# EasyEDA schematic 1-Schematic_h-bridge driver arduino.json
TITLE: New Schematic; REV: 1.0; Date: 2018-12-11; Sheet: 1/1; Drawn By: ROBBLLOYD
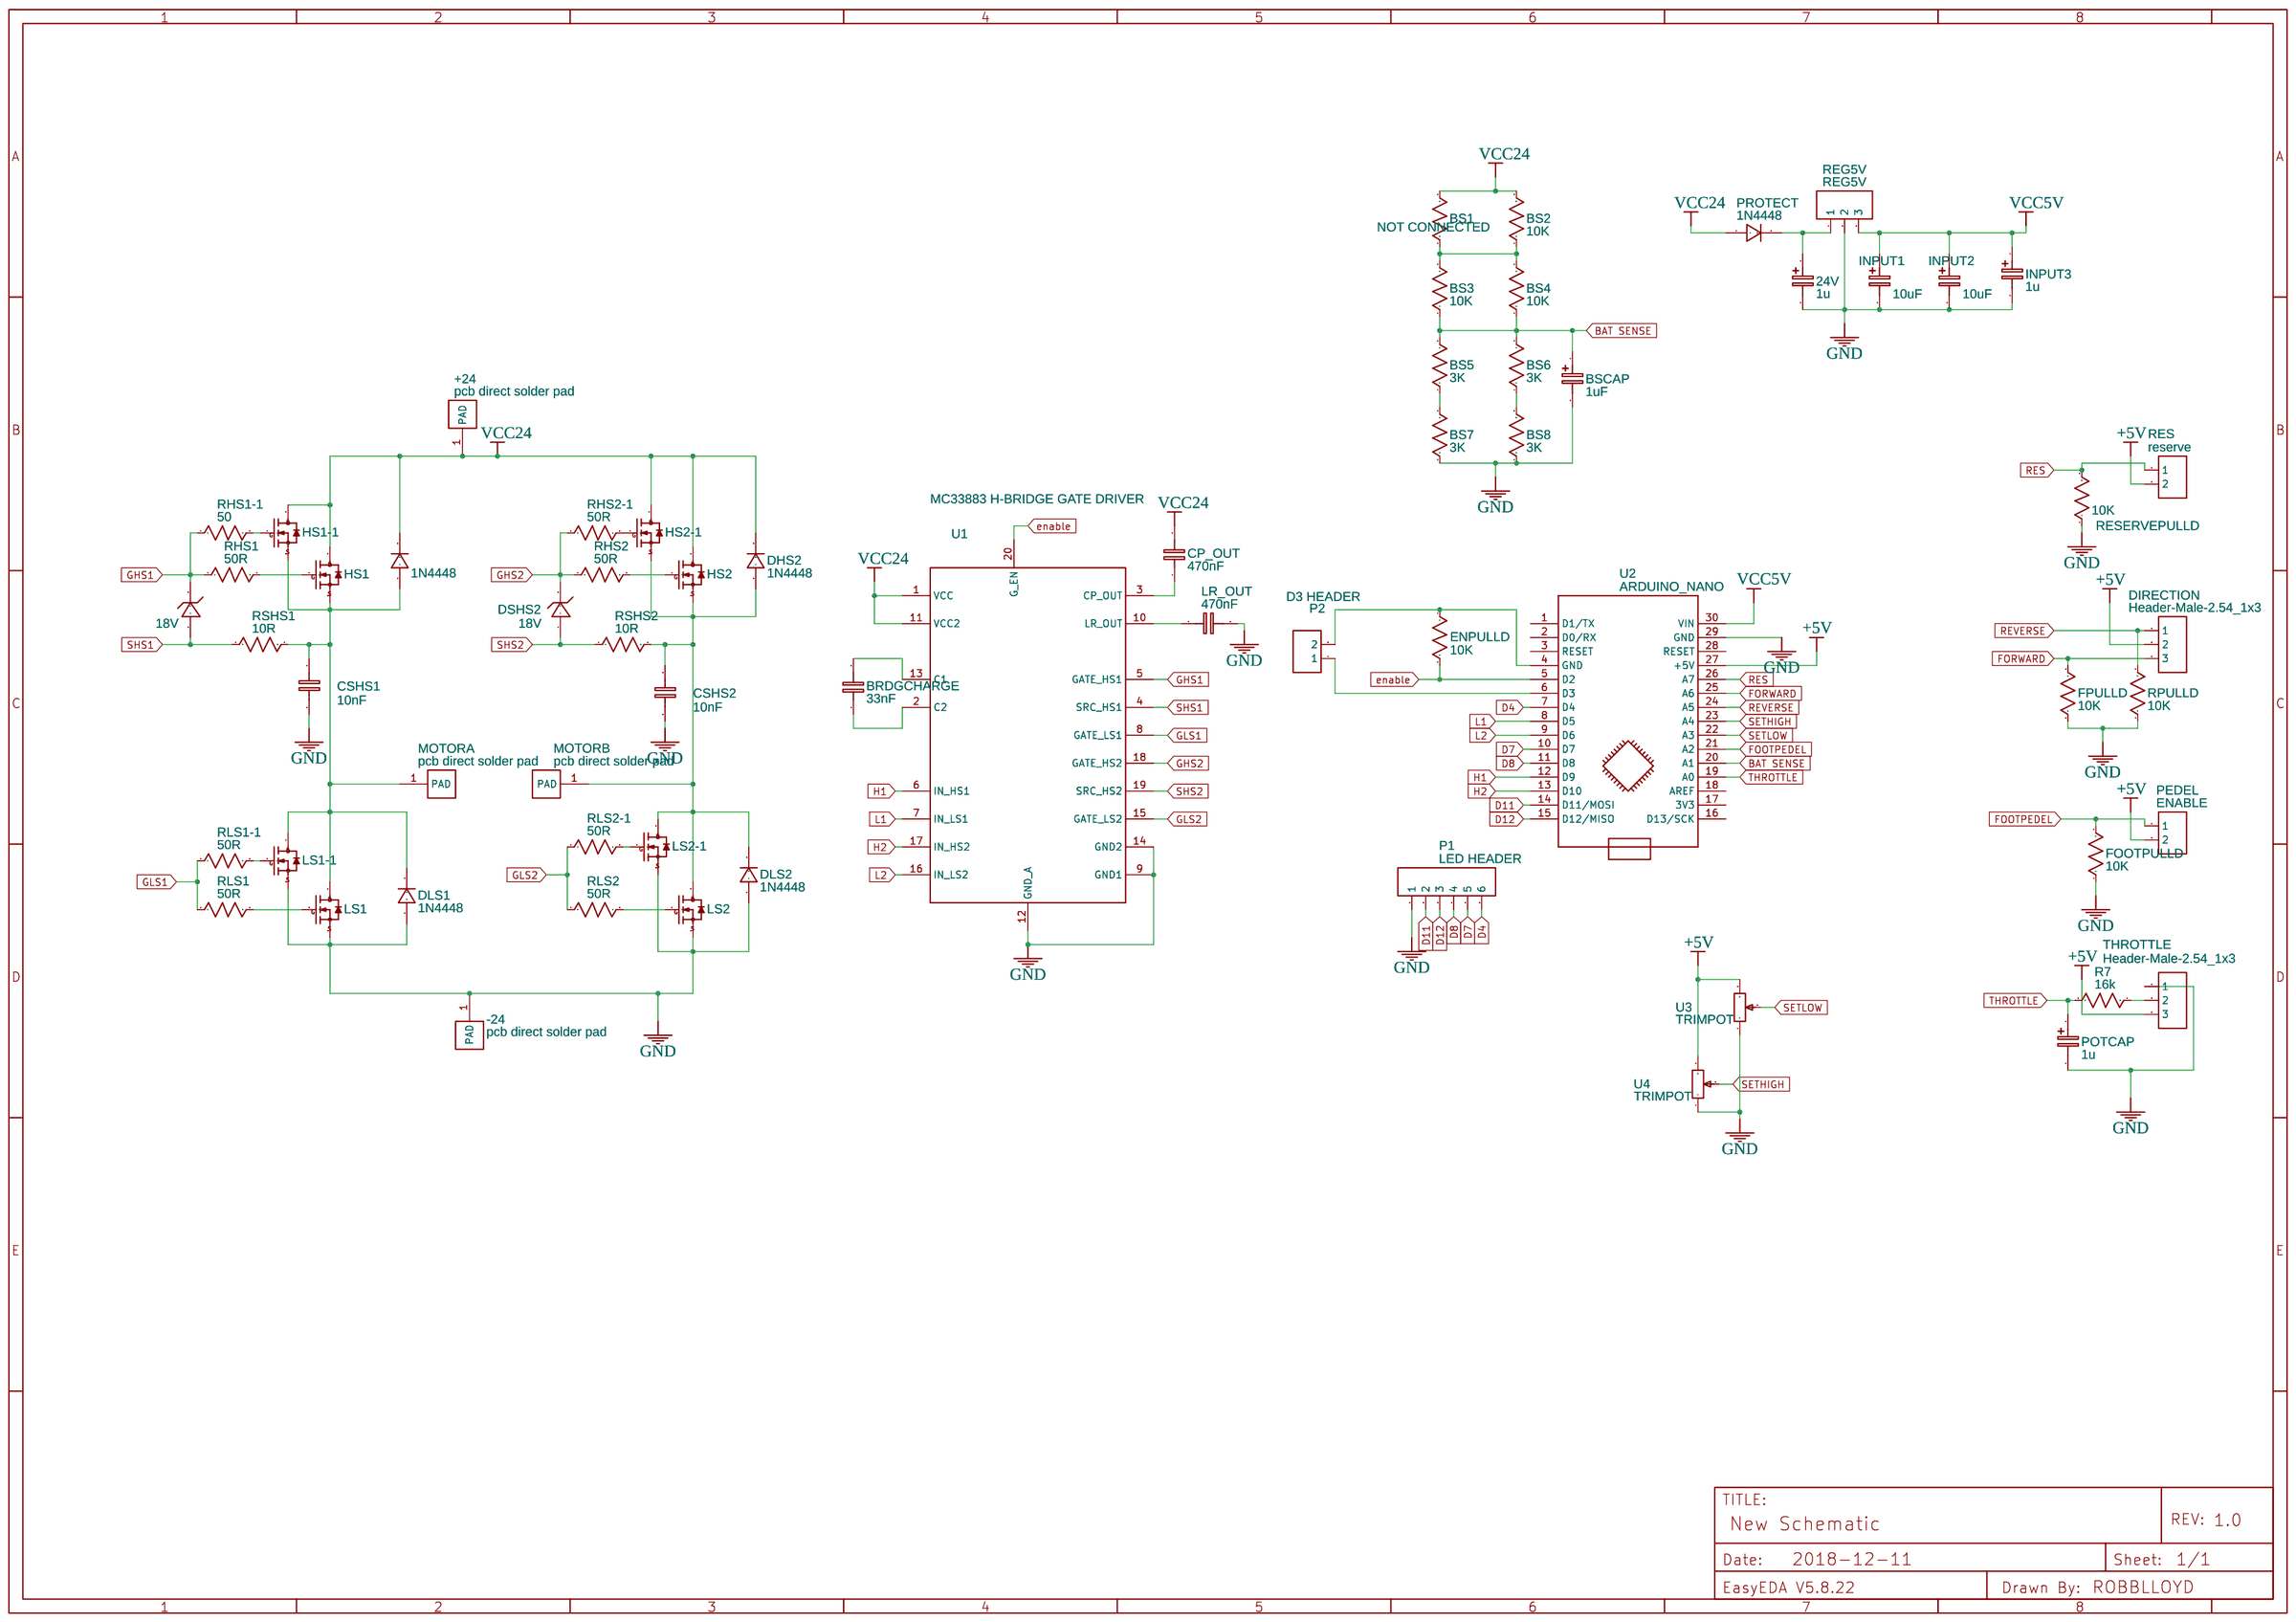
[diagram p0: schematic sheet]

## Parts
24V  1u  [CAP-T-5*5.2]
+24  pcb direct solder pad  [DIRECT SOLDER PAD]
-24  pcb direct solder pad  [DIRECT SOLDER PAD]
BRDGCHARGE  33nF  [0805]
BS1  NOT CONNECTED  [0805]
BS2  10K  [0805]
BS3  10K  [0805]
BS4  10K  [0805]
BS5  3K  [0805]
BS6  3K  [0805]
BS7  3K  [0805]
BS8  3K  [0805]
BSCAP  1uF  [0805]
CP_OUT  470nF  [0805]
CSHS1  10nF  [0805]
CSHS2  10nF  [0805]
DHS1  1N4448  [DO-27]
DHS2  1N4448  [DO-27]
DIRECTION  Header-Male-2.54_1x3  [HDR-3X1/2.54]
DLS1  1N4448  [DO-27]
DLS2  1N4448  [DO-27]
DSHS1  18V  [SOD-80C]
DSHS2  18V  [SOD-80C]
ENPULLD  10K  [0805]
FOOTPULLD  10K  [0805]
FPULLD  10K  [0805]
HS1  CEP6060L  [TO-220(TO-220-3)]
HS1-1  CEP6060L  [TO-220(TO-220-3)]
HS2  CEP6060L  [TO-220(TO-220-3)]
HS2-1  CEP6060L  [TO-220(TO-220-3)]
INPUT1  10uF  [CAP-T-5*5.2]
INPUT2  10uF  [CAP-T-5*5.2]
INPUT3  1u  [0805]
LR_OUT  470nF  [0805]
LS1  CEP6060L  [TO-220(TO-220-3)]
LS1-1  CEP6060L  [TO-220(TO-220-3)]
LS2  CEP6060L  [TO-220(TO-220-3)]
LS2-1  CEP6060L  [TO-220(TO-220-3)]
MOTORA  pcb direct solder pad  [DIRECT SOLDER PAD]
MOTORB  pcb direct solder pad  [DIRECT SOLDER PAD]
P1  LED HEADER  [HDR-6X1/2.54]
P2  D3 HEADER  [HDR-1X2/2.54]
PEDEL  ENABLE  [HDR-1X2/2.54]
POTCAP  1u  [0805]
PROTECT  1N4448  [DO-35]
R7  16k  [0805]
REG5V  REG5V  [HDR-3X1/2.54]
RES  reserve  [HDR-1X2/2.54]
RESERVEPULLD  10K  [0805]
RHS1  50R  [0805]
RHS1-1  50  [0805]
RHS2  50R  [0805]
RHS2-1  50R  [0805]
RLS1  50R  [0805]
RLS1-1  50R  [0805]
RLS2  50R  [0805]
RLS2-1  50R  [0805]
RPULLD  10K  [0805]
RSHS1  10R  [0805]
RSHS2  10R  [0805]
THROTTLE  Header-Male-2.54_1x3  [HDR-3X1/2.54]
U1  MC33883 H-BRIDGE GATE DRIVER  [20-SOIC (7.50 MM)]
U2  ARDUINO_NANO  [ARDUINO_NANO]
U3  TRIMPOT  [TRIMPOT]
U4  TRIMPOT  [TRIMPOT]

## Library data of the parts
24V BSCAP INPUT1-INPUT3 POTCAP = Cap_Electrolytic(TH)_D6.3XF2.5_EU: Contributor: EasyEDA; Manufacturer Part: ?
+24 -24 MOTORA MOTORB = -: Manufacturer Part: ?; Supplier Part: undefined; Contributor: ROBBLLOYD
BRDGCHARGE CP_OUT CSHS1 CSHS2 LR_OUT = Cap_RAD-0.1_EU: Manufacturer Part: ?
BS1-BS8 ENPULLD FOOTPULLD FPULLD R7 RESERVEPULLD RHS1 RHS1-1 RHS2 RHS2-1 RLS1 RLS1-1 RLS2 RLS2-1 RPULLD RSHS1 RSHS2 = Res_AXIAL-0.4(1/4W)_US: Manufacturer Part: ?
DHS1 DHS2 DLS1 DLS2 PROTECT = -: Supplier Part: C54037; Supplier: LCSC; Manufacturer: SEMTECH; image: //image.lceda.cn/szlcsc/C54037.jpg
DIRECTION REG5V THROTTLE = -: Supplier Part: C49257; Supplier: LCSC; Manufacturer: BOOMELE; Manufacturer Part: Header2.54mm 1*3P; image: //image.lceda.cn/szlcsc/C49257.jpg
DSHS1 DSHS2 = -: Supplier Part: C53170; Supplier: LCSC; Manufacturer: ON; Manufacturer Part: 1SMB5925BT3G; image: //image.lceda.cn/szlcsc/C53170.jpg
HS1 HS1-1 HS2 HS2-1 LS1 LS1-1 LS2 LS2-1 = -: Supplier: LCSC; Manufacturer: CET; Contributor: LCSC; Supplier Part: C154171
P1 = -: Supplier Part: C37208; Supplier: LCSC; Manufacturer: BOOMELE; Manufacturer Part: Header-Male-2.54_1x6
P2 PEDEL RES = -: Supplier Part: C49661; Supplier: LCSC; Manufacturer: BOOMELE; Manufacturer Part: 2.54-1*2PFemale; image: //image.lceda.cn/szlcsc/C49661.jpg
U1 = -: Manufacturer Part: ?; Supplier Part: undefined; Supplier: Mouser; link: https://www.nxp.com/docs/en/data-sheet/MC33883.pdf; Contributor: ROBBLLOYD
U2 = -: sourceId: KGSeAWhDB; Manufacturer Part: ?
U3 U4 = -: Manufacturer Part: ?; Contributor: ROBBLLOYD

## Nets
+5V: DIRECTION.2 PEDEL.2 RES.2 THROTTLE.3 U2.27(+5V) U3.3 U4.3
GND: 24V.2 -24.1(PAD) BS7.1 BS8.1 BSCAP.2 CSHS1.2 CSHS2.2 DLS1.1(A) DLS2.1(A) FOOTPULLD.1 FPULLD.1 INPUT1.2 INPUT2.2 INPUT3.2 LR_OUT.2 LS1.3(S) LS1-1.3(S) LS2.3(S) LS2-1.3(S) P1.1 POTCAP.2 REG5V.2 RESERVEPULLD.1 RPULLD.1 THROTTLE.1 U1.9(GND1) U1.12(GND_A) U1.14(GND2) U2.29(GND) U3.1 U4.1
VCC5V: INPUT1.1 INPUT2.1 INPUT3.1 REG5V.3 U2.30(VIN)
VCC24: +24.1(PAD) BS1.2 BS2.2 CP_OUT.2 DHS1.2(K) DHS2.2(K) HS1.2(D) HS1-1.2(D) HS2.2(D) HS2-1.2(D) PROTECT.1(A) U1.1(VCC) U1.11(VCC2)
BAT SENSE: BS3.1 BS4.1 BS5.2 BS6.2 BSCAP.1 U2.20(A1)
D4: P1.6 U2.7(D4)
D7: P1.5 U2.10(D7)
D8: P1.4 U2.11(D8)
D11: P1.2 U2.14(D11/MOSI)
D12: P1.3 U2.15(D12/MISO)
enable: ENPULLD.2 U1.20(G_EN) U2.5(D2)
FOOTPEDEL: FOOTPULLD.2 PEDEL.1 U2.21(A2)
FORWARD: DIRECTION.3 FPULLD.2 U2.25(A6)
GHS1: DSHS1.2(K) RHS1.1 RHS1-1.1 U1.5(GATE_HS1)
GHS2: DSHS2.2(K) RHS2.1 RHS2-1.1 U1.18(GATE_HS2)
GLS1: RLS1.1 RLS1-1.1 U1.8(GATE_LS1)
GLS2: RLS2.1 RLS2-1.1 U1.15(GATE_LS2)
H1: U1.6(IN_HS1) U2.12(D9)
H2: U1.17(IN_HS2) U2.13(D10)
L1: U1.7(IN_LS1) U2.8(D5)
L2: U1.16(IN_LS2) U2.9(D6)
RES: RES.1 RESERVEPULLD.2 U2.26(A7)
REVERSE: DIRECTION.1 RPULLD.2 U2.24(A5)
SETHIGH: U2.23(A4) U4.2
SETLOW: U2.22(A3) U3.2
SHS1: DSHS1.1(A) RSHS1.1 U1.4(SRC_HS1)
SHS2: DSHS2.1(A) RSHS2.1 U1.19(SRC_HS2)
THROTTLE: POTCAP.1 R7.2 U2.19(A0)
Net-(24V-1): 24V.1 PROTECT.2(K) REG5V.1
Net-(BRDGCHARGE-1): BRDGCHARGE.1 U1.2(C2)
Net-(BRDGCHARGE-2): BRDGCHARGE.2 U1.13(C1)
Net-(BS1-1): BS1.1 BS2.1 BS3.2 BS4.2
Net-(BS5-1): BS5.1 BS7.2
Net-(BS6-1): BS6.1 BS8.2
Net-(CP_OUT-1): CP_OUT.1 U1.3(CP_OUT)
Net-(CSHS1-1): CSHS1.1 DHS1.1(A) DLS1.2(K) HS1.3(S) HS1-1.3(S) LS1.2(D) LS1-1.2(D) MOTORA.1(PAD) RSHS1.2
Net-(CSHS2-1): CSHS2.1 DHS2.1(A) DLS2.2(K) HS2.3(S) HS2-1.3(S) LS2.2(D) LS2-1.2(D) MOTORB.1(PAD) RSHS2.2
Net-(ENPULLD-1): ENPULLD.1 P2.2 U2.4(GND)
Net-(HS1-1): HS1.1(G) RHS1.2
Net-(HS1-1-1): HS1-1.1(G) RHS1-1.2
Net-(HS2-1): HS2.1(G) RHS2.2
Net-(HS2-1-1): HS2-1.1(G) RHS2-1.2
Net-(LR_OUT-1): LR_OUT.1 U1.10(LR_OUT)
Net-(LS1-1): LS1.1(G) RLS1.2
Net-(LS1-1-1): LS1-1.1(G) RLS1-1.2
Net-(LS2-1): LS2.1(G) RLS2.2
Net-(LS2-1-1): LS2-1.1(G) RLS2-1.2
Net-(P2-1): P2.1 U2.6(D3)
Net-(R7-1): R7.1 THROTTLE.2

Not connected (* = marked no-connect by the designer): U2 1(D1/TX) 2(D0/RX) 3(RESET) 16(D13/SCK) 17(3V3) 18(AREF) 28(RESET)
